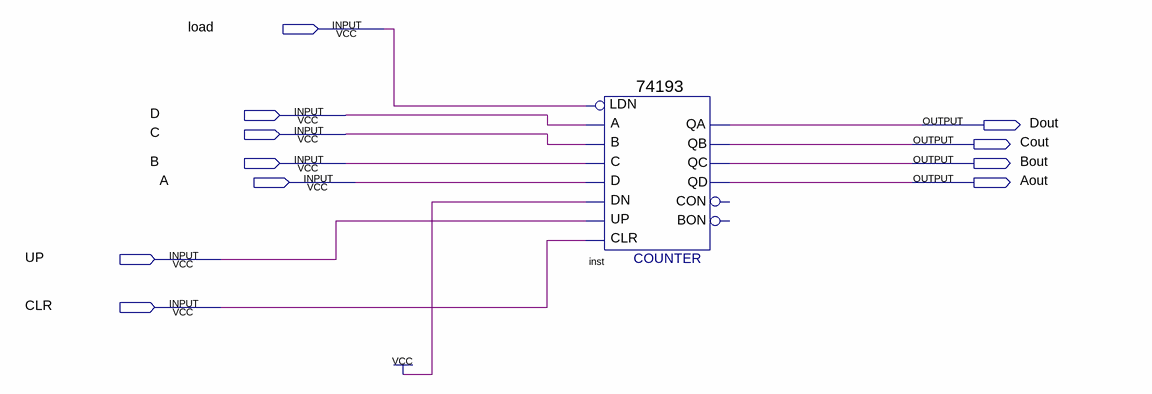
[diagram p0: schematic sheet]
// Quartus schematic FourBitUpCounter.bdf as structural Verilog: 1 symbols, 11 pins
module FourBitUpCounter (
  input  load,
  input  D,
  input  C,
  input  B,
  input  A,
  input  UP,
  input  CLR,
  output Dout,
  output Cout,
  output Bout,
  output Aout
);

  \74193  inst (
    .D(A), .C(B), .B(C), .A(D), .CLR(CLR), .UP(UP), .DN(1'b1), .LDN(load), .QB(Cout), .QA(Dout), .QD(Aout),
    .QC(Bout));  // open: CON, BON
endmodule
